# EAGLE design Smart Camera Powersupply Rev1.0 (EAGLE 7.7.0)
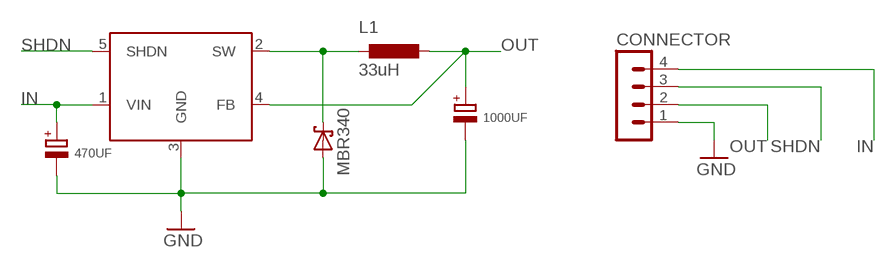
[diagram p0: schematic, sheet 1]

## Parts
C1  1000UF  [1000UF]
C2  470UF  [470UF]
CONNECTOR  MA04-1  [MA04-1]
L1  33uH  L_33UH  [L_33UH]
U$1  MBR340  [MBR340]
U$2  MIC4576  [MIC4576]

## Nets
GND: C1.P$2 C2.P$2 CONNECTOR.1 U$1.P$2(C) U$2.3(GND)
IN: C2.P$1 CONNECTOR.4 U$2.1(VIN)
N$1: L1.P$2 U$1.P$1(A) U$2.2(SW)
OUT: C1.P$1 CONNECTOR.2 L1.P$1 U$2.4(FB)
SHDN: CONNECTOR.3 U$2.5(SHDN)

## Library data of the parts
C1 = Smart Camera Powersupply:1000UF: ELektrolyt Capacitor
C2 = Smart Camera Powersupply:470UF: ELektrolyt Capacitor
CONNECTOR = con-lstb:MA04-1: PIN HEADER; OC_FARNELL: unknown; OC_NEWARK: unknown
L1 = Smart Camera Powersupply:L_33UH
U$1 = Smart Camera Powersupply:MBR340
U$2 = Smart Camera Powersupply:MIC4576

## Net classes
0 default: clearance 0.508 mm

## Board
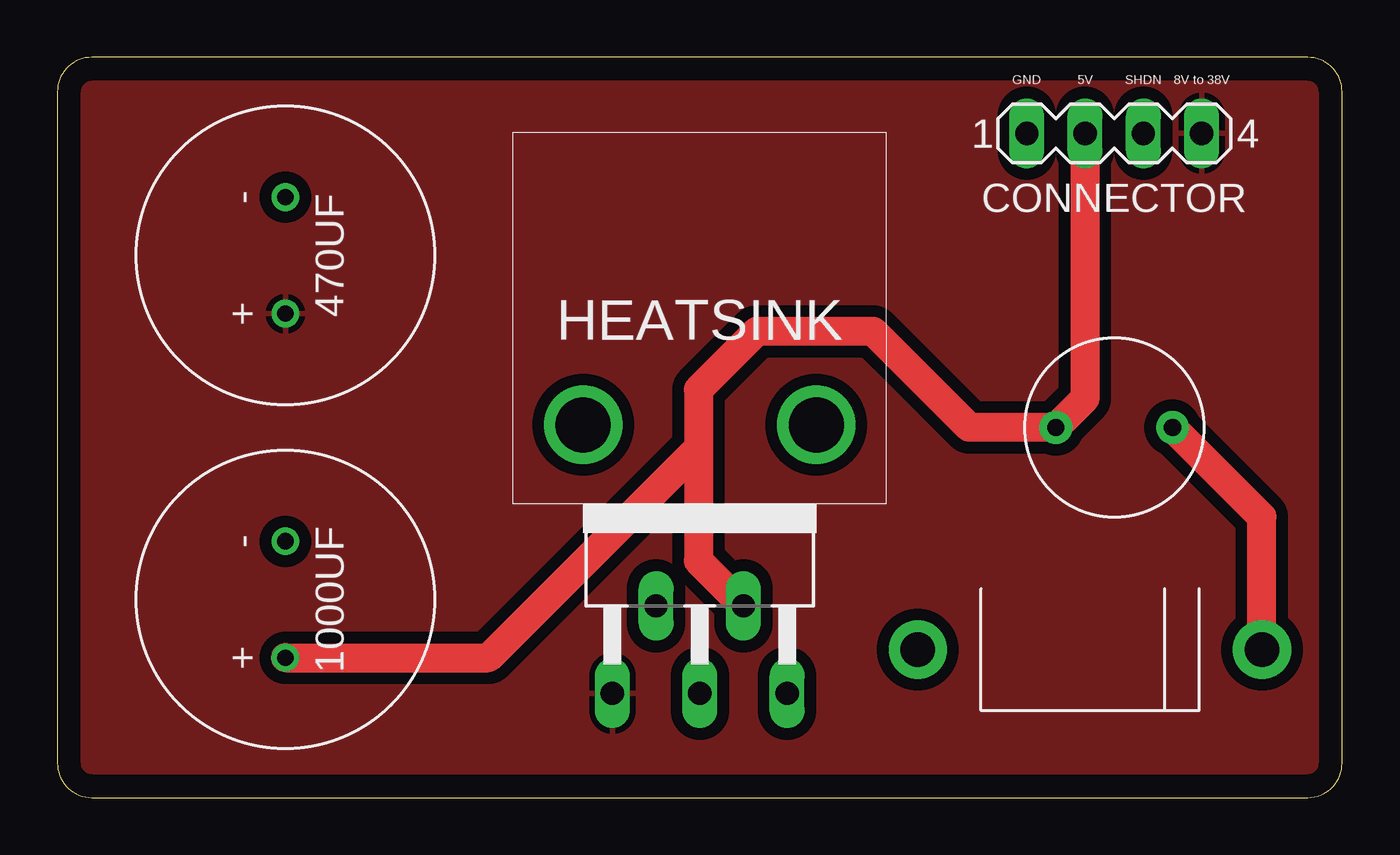
[diagram p1: board, top side]
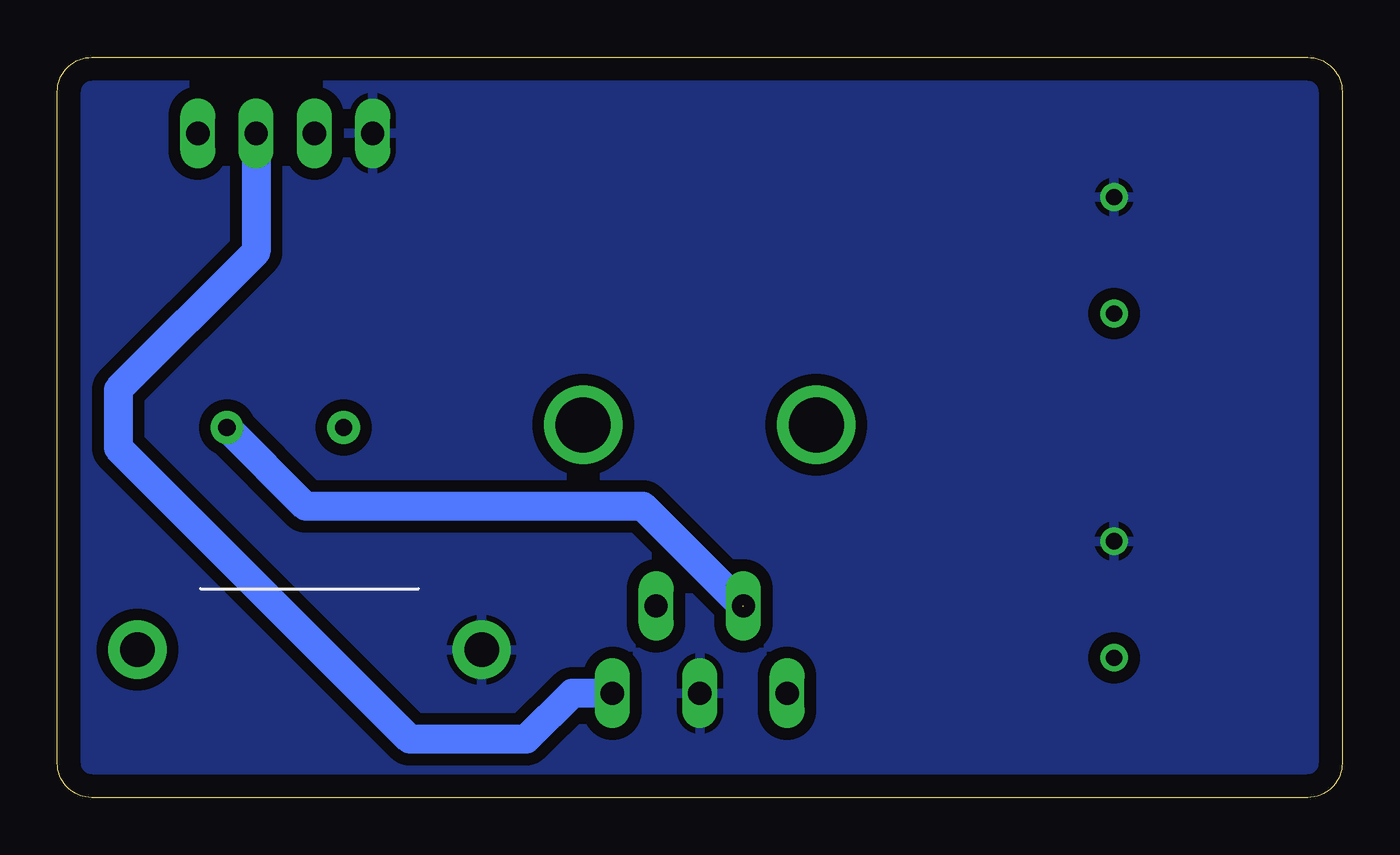
[diagram p2: board, bottom side, seen from below]

Size 56 x 32.27 mm. Coordinates in mm from the lower left corner, seen from the top.
Outline: 0,30.77 0,1.5 arc90 1.5,0 54.5,0 arc90 56,1.5 56,30.77 arc90 54.5,32.27 1.5,32.27 arc90 0,30.77
Copper layers (1*16): Top 0.035mm / dielectric 1.5mm / Bottom 0.035mm
Design rules "default": minimum track width 10mil, minimum drill 24mil, track to track 8mil, track to pad 8mil, pad to pad 8mil, via to via 8mil, smd to smd 8mil, copper to edge 40mil, drill to drill 8mil, minimum pad ring 10mil, minimum via ring 8mil, stop-mask expansion 4mil, vias tented up to drill 0mil, thermal gap 10mil

### Footprints (pad centres in the part's own frame; a part is rotated, then mirrored left to right if it is on the bottom)
1000UF = drill 0.7: P$1 -2.54,0; P$2 2.54,0
470UF = drill 0.7: P$1 -2.54,0; P$2 2.54,0
MA04-1 = drill 1.016 long: 1 -3.81,0; 2 -1.27,0; 3 1.27,0; 4 3.81,0
L_33UH = drill 0.75 pad 1.422: P$1 -2.54,0; P$2 2.54,0
MBR340 = drill 1.5 pad 2.54: P$1 7.5,0; P$2 -7.5,0
MIC4576 = drill 1.016 long: 1 -3.81,-8.255; 2 -1.905,-4.445; 3 0,-8.255; 4 1.905,-4.445; 5 3.81,-8.255

### Placement (x,y rotation side)
C1  9.94,8.63 90 top
C2  9.94,23.64 90 top
CONNECTOR  46.06,28.96 0 top
L1  46.06,16.14 0 top
U$1  45.01,6.45 0 top
U$2  28,12.8 0 top

### Tracks (layer width: path | path; a pad name or v marks a point on that pad's centre or on a via)
GND
  pour Bottom: -2.54,33.02 -2.54,-1.27 58.42,-1.27 58.42,34.29 -2.54,34.29
IN
  pour Top: -2.54,35.56 -2.54,-2.54 58.42,-2.54 58.42,35.56
N$1  (1 unrouted)
  Top 1.27: U$1.P$1 52.51,12.23 L1.P$2
  Bottom 1.27: 26.14,8.36 30.48,12.7 45.17,12.7 L1.P$2
N$2  (via drill 2.4)
  other vias: 22.92,16.25
N$3  (via drill 2.4)
  other vias: 33.08,16.25
OUT
  Top 1.27: CONNECTOR.2 44.8,17.41 L1.P$1 39.74,16.14 35.56,20.32 30.48,20.32 27.94,17.78 27.94,15.24 | 27.94,15.24 27.94,10.32 U$2.4 | C1.P$1 18.8,6.09 27.94,15.24
SHDN
  Bottom 1.27: U$2.5 33.55,4.54 35.56,2.54 40.64,2.54 53.34,15.24 53.34,17.78 47.34,23.79 CONNECTOR.3

### Text on the board
tPlace: GND | 5V | SHDN | 8V to 38V | HEATSINK